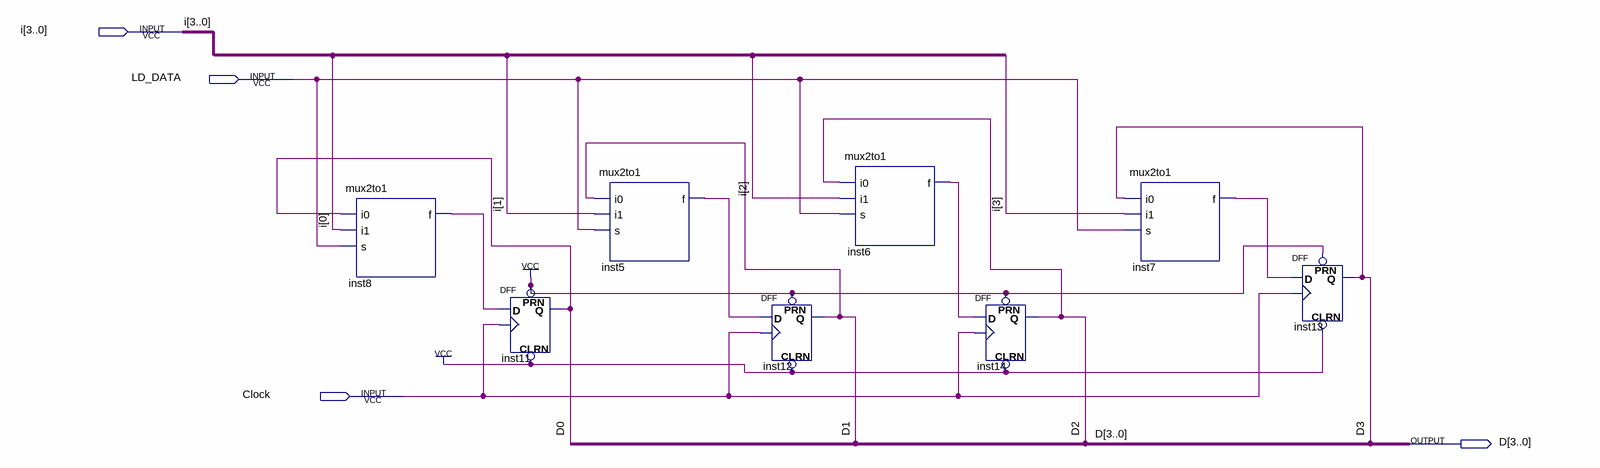
[diagram p0: schematic sheet]
// Quartus schematic Rfile.bdf as structural Verilog: 8 symbols, 4 pins
module Rfile (
  input  [3:0] i,
  input  LD_DATA,
  input  Clock,
  output [3:0] D
);

  wire inst5_f, inst6_f, inst7_f, inst8_f;

  mux2to1 inst8 (.i0(D[0]), .i1(i[0]), .s(LD_DATA), .f(inst8_f));
  DFF inst11 (.CLRN(1'b1), .CLK(Clock), .D(inst8_f), .PRN(1'b1), .Q(D[0]));
  mux2to1 inst5 (.i0(D[1]), .i1(i[1]), .s(LD_DATA), .f(inst5_f));
  DFF inst12 (.CLRN(1'b1), .CLK(Clock), .D(inst5_f), .PRN(1'b1), .Q(D[1]));
  mux2to1 inst6 (.i0(D[2]), .i1(i[2]), .s(LD_DATA), .f(inst6_f));
  DFF inst14 (.CLRN(1'b1), .CLK(Clock), .D(inst6_f), .PRN(1'b1), .Q(D[2]));
  mux2to1 inst7 (.i0(D[3]), .i1(i[3]), .s(LD_DATA), .f(inst7_f));
  DFF inst13 (.CLRN(1'b1), .CLK(Clock), .D(inst7_f), .PRN(1'b1), .Q(D[3]));
endmodule
